# Altium schematic sheet fre_oa.SchDoc
size A4
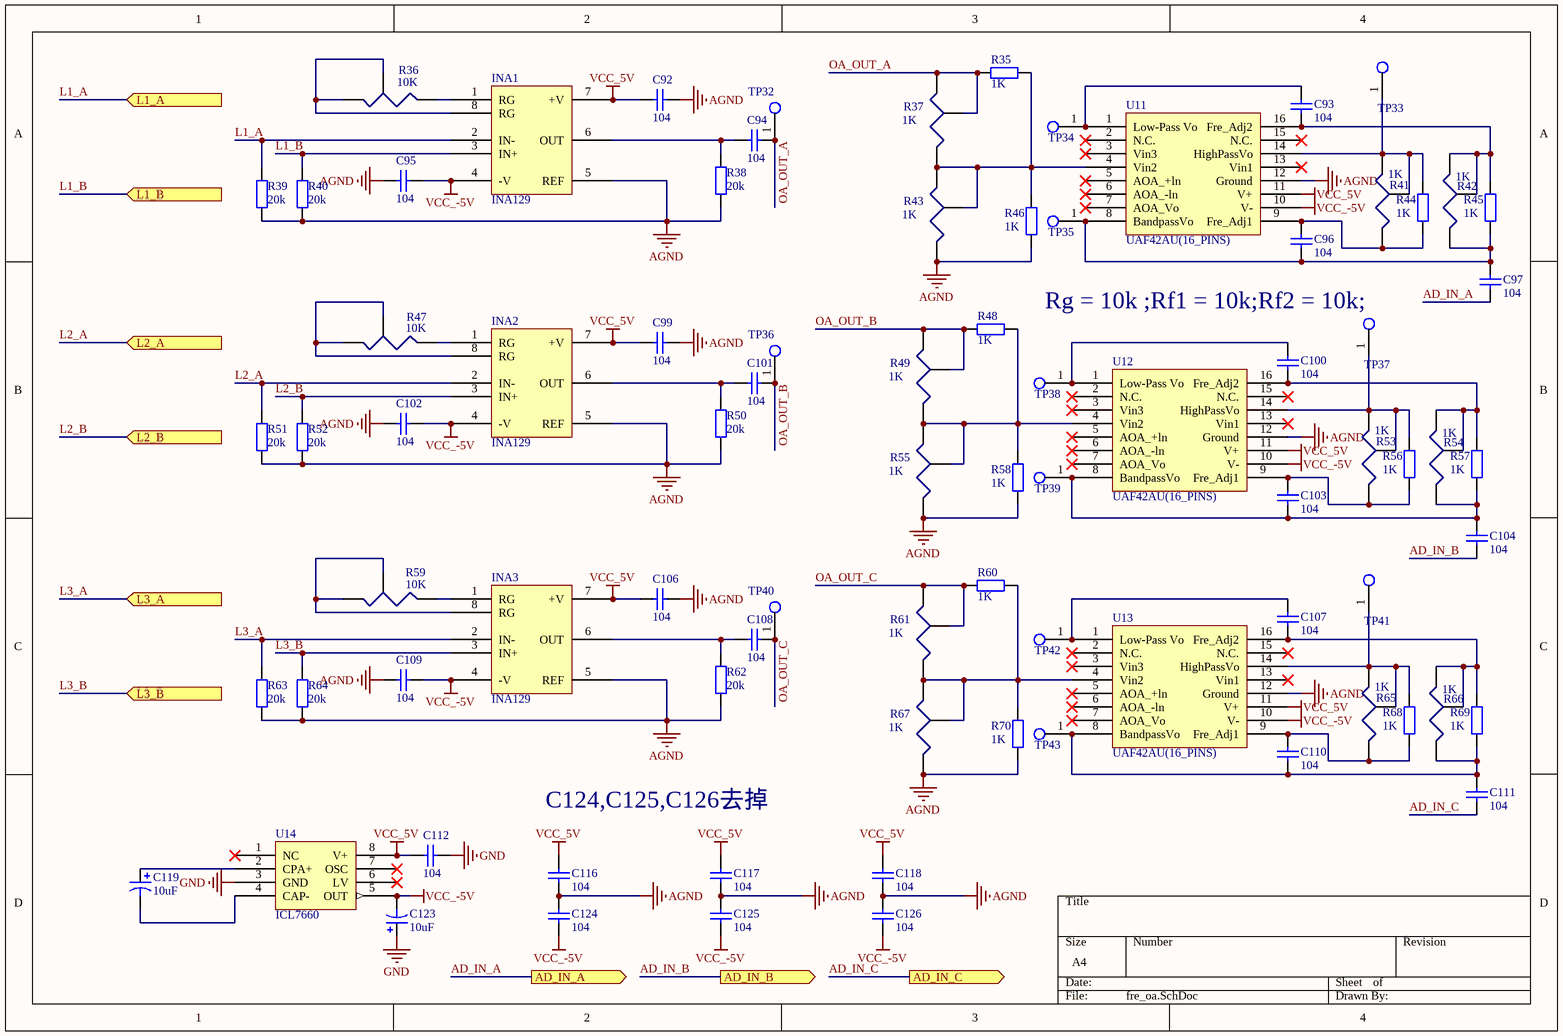
[diagram p0: fre_oa.SchDoc]

## Parts
C92  value 104  [0603]  (hidden comment: Cap)
C93  value 104  [0603]  (hidden comment: Cap)
C94  value 104  [0603]  (hidden comment: Cap)
C95  value 104  [0603]  (hidden comment: Cap)
C96  value 104  [0603]  (hidden comment: Cap)
C97  value 104  [0603]  (hidden comment: Cap)
C99  value 104  [0603]  (hidden comment: Cap)
C100  value 104  [0603]  (hidden comment: Cap)
C101  value 104  [0603]  (hidden comment: Cap)
C102  value 104  [0603]  (hidden comment: Cap)
C103  value 104  [0603]  (hidden comment: Cap)
C104  value 104  [0603]  (hidden comment: Cap)
C106  value 104  [0603]  (hidden comment: Cap)
C107  value 104  [0603]  (hidden comment: Cap)
C108  value 104  [0603]  (hidden comment: Cap)
C109  value 104  [0603]  (hidden comment: Cap)
C110  value 104  [0603]  (hidden comment: Cap)
C111  value 104  [0603]  (hidden comment: Cap)
C112  value 104  [0603]  (hidden comment: Cap)
C116  value 104  [0603]  (hidden comment: Cap)
C117  value 104  [0603]  (hidden comment: Cap)
C118  value 104  [0603]  (hidden comment: Cap)
C119  value 10uF  [Cap 3528B]  (hidden comment: Cap Poll)
C123  value 10uF  [Cap 3528B]  (hidden comment: Cap Poll)
C124  value 104  [0603]  (hidden comment: Cap)
C125  value 104  [0603]  (hidden comment: Cap)
C126  value 104  [0603]  (hidden comment: Cap)
INA1  INA129  [LM386]
INA2  INA129  [LM386]
INA3  INA129  [LM386]
R35  value 1K  [0603]  (hidden comment: Res)
R36  value 10K  [电位器WH06-2C]  (hidden comment: 电位器)
R37  value 1K  [电位器WH06-2C]  (hidden comment: 电位器)
R38  value 20k  [0603]  (hidden comment: Res)
R39  value 20k  [0603]  (hidden comment: Res)
R40  value 20k  [0603]  (hidden comment: Res)
R41  value 1K  [电位器WH06-2C]  (hidden comment: 电位器)
R42  value 1K  [电位器WH06-2C]  (hidden comment: 电位器)
R43  value 1K  [电位器WH06-2C]  (hidden comment: 电位器)
R44  value 1K  [0603]  (hidden comment: Res)
R45  value 1K  [0603]  (hidden comment: Res)
R46  value 1K  [0603]  (hidden comment: Res)
R47  value 10K  [电位器WH06-2C]  (hidden comment: 电位器)
R48  value 1K  [0603]  (hidden comment: Res)
R49  value 1K  [电位器WH06-2C]  (hidden comment: 电位器)
R50  value 20k  [0603]  (hidden comment: Res)
R51  value 20k  [0603]  (hidden comment: Res)
R52  value 20k  [0603]  (hidden comment: Res)
R53  value 1K  [电位器WH06-2C]  (hidden comment: 电位器)
R54  value 1K  [电位器WH06-2C]  (hidden comment: 电位器)
R55  value 1K  [电位器WH06-2C]  (hidden comment: 电位器)
R56  value 1K  [0603]  (hidden comment: Res)
R57  value 1K  [0603]  (hidden comment: Res)
R58  value 1K  [0603]  (hidden comment: Res)
R59  value 10K  [电位器WH06-2C]  (hidden comment: 电位器)
R60  value 1K  [0603]  (hidden comment: Res)
R61  value 1K  [电位器WH06-2C]  (hidden comment: 电位器)
R62  value 20k  [0603]  (hidden comment: Res)
R63  value 20k  [0603]  (hidden comment: Res)
R64  value 20k  [0603]  (hidden comment: Res)
R65  value 1K  [电位器WH06-2C]  (hidden comment: 电位器)
R66  value 1K  [电位器WH06-2C]  (hidden comment: 电位器)
R67  value 1K  [电位器WH06-2C]  (hidden comment: 电位器)
R68  value 1K  [0603]  (hidden comment: Res)
R69  value 1K  [0603]  (hidden comment: Res)
R70  value 1K  [0603]  (hidden comment: Res)
TP32  testPoint  [TP_H]  (value not drawn)
TP33  testPoint  [TP_H]  (value not drawn)
TP34  testPoint  [TP_H]  (value not drawn)
TP35  testPoint  [TP_H]  (value not drawn)
TP36  testPoint  [TP_H]  (value not drawn)
TP37  testPoint  [TP_H]  (value not drawn)
TP38  testPoint  [TP_H]  (value not drawn)
TP39  testPoint  [TP_H]  (value not drawn)
TP40  testPoint  [TP_H]  (value not drawn)
TP41  testPoint  [TP_H]  (value not drawn)
TP42  testPoint  [TP_H]  (value not drawn)
TP43  testPoint  [TP_H]  (value not drawn)
U11  UAF42AU(16_PINS)  [SOIC127P1030X265-16N]
U12  UAF42AU(16_PINS)  [SOIC127P1030X265-16N]
U13  UAF42AU(16_PINS)  [SOIC127P1030X265-16N]
U14  ICL7660  [ICL7660 sop-8]

## Ports
AD_IN_A (out), AD_IN_B (out), AD_IN_C (out), L1_A (in), L1_B (in), L2_A (in), L2_B (in), L3_A (in), L3_B (in)

## Nets
AGND: C92.2 C95.1 C99.2 C102.1 C106.2 C109.1 C116.1 C117.1 C118.1 C124.2 C125.2 C126.2 INA1.5(REF) INA2.5(REF) INA3.5(REF) R38.1 R39.1 R40.1 R43.1 R46.1 R50.1 R51.1 R52.1 R55.1 R58.1 R62.1 R63.1 R64.1 R67.1 R70.1 U11.12(Ground) U12.12(Ground) U13.12(Ground)
GND: C112.2 C123.1 U14.3(GND)
VCC_5V: C92.1 C99.1 C106.1 C112.1 C116.2 C117.2 C118.2 INA1.7(+V) INA2.7(+V) INA3.7(+V) U11.11(V+) U12.11(V+) U13.11(V+) U14.8(V+)
VCC_-5V: C95.2 C102.2 C109.2 C123.2 C124.1 C125.1 C126.1 INA1.4(-V) INA2.4(-V) INA3.4(-V) U11.10(V-) U12.10(V-) U13.10(V-) U14.5(OUT)
AD_IN_A: C97.2 ; port AD_IN_A
AD_IN_B: C104.2 ; port AD_IN_B
AD_IN_C: C111.2 ; port AD_IN_C
L1_A: INA1.2(IN-) R39.2 ; port L1_A
L1_B: INA1.3(IN+) R40.2 ; port L1_B
L2_A: INA2.2(IN-) R51.2 ; port L2_A
L2_B: INA2.3(IN+) R52.2 ; port L2_B
L3_A: INA3.2(IN-) R63.2 ; port L3_A
L3_B: INA3.3(IN+) R64.2 ; port L3_B
OA_OUT_A: C94.2 R35.1 R37.2 R37.3 TP32.1
OA_OUT_B: C101.2 R48.1 R49.2 R49.3 TP36.1
OA_OUT_C: C108.2 R60.1 R61.2 R61.3 TP40.1
NetC93_1: C93.1 TP34.1 U11.1(Low-Pass_Vo)
NetC93_2: C93.2 R42.2 R42.3 R45.2 U11.16(Fre_Adj2)
NetC94_1: C94.1 INA1.6(OUT) R38.2
NetC96_1: C96.1 R41.1 R44.1 U11.9(Fre_Adj1)
NetC96_2: C96.2 C97.1 R42.1 R45.1 TP35.1 U11.8(BandpassVo)
NetC100_1: C100.1 TP38.1 U12.1(Low-Pass_Vo)
NetC100_2: C100.2 R54.2 R54.3 R57.2 U12.16(Fre_Adj2)
NetC101_1: C101.1 INA2.6(OUT) R50.2
NetC103_1: C103.1 R53.1 R56.1 U12.9(Fre_Adj1)
NetC103_2: C103.2 C104.1 R54.1 R57.1 TP39.1 U12.8(BandpassVo)
NetC107_1: C107.1 TP42.1 U13.1(Low-Pass_Vo)
NetC107_2: C107.2 R66.2 R66.3 R69.2 U13.16(Fre_Adj2)
NetC108_1: C108.1 INA3.6(OUT) R62.2
NetC110_1: C110.1 R65.1 R68.1 U13.9(Fre_Adj1)
NetC110_2: C110.2 C111.1 R66.1 R69.1 TP43.1 U13.8(BandpassVo)
NetC119_1: C119.1 U14.2(CPA+)
NetC119_2: C119.2 U14.4(CAP-)
NetINA1_1: INA1.1(RG) R36.1
NetINA1_8: INA1.8(RG) R36.2 R36.3
NetINA2_1: INA2.1(RG) R47.1
NetINA2_8: INA2.8(RG) R47.2 R47.3
NetINA3_1: INA3.1(RG) R59.1
NetINA3_8: INA3.8(RG) R59.2 R59.3
NetR35_2: R35.2 R37.1 R43.2 R43.3 R46.2 U11.4(Vin2)
NetR41_2: R41.2 R41.3 R44.2 TP33.1 U11.14(HighPassVo)
NetR48_2: R48.2 R49.1 R55.2 R55.3 R58.2 U12.4(Vin2)
NetR53_2: R53.2 R53.3 R56.2 TP37.1 U12.14(HighPassVo)
NetR60_2: R60.2 R61.1 R67.2 R67.3 R70.2 U13.4(Vin2)
NetR65_2: R65.2 R65.3 R68.2 TP41.1 U13.14(HighPassVo)

Not connected (* = marked no-connect by the designer): U11 2(N.C.)* 3(Vin3)* 5(AOA_+ln)* 6(AOA_-ln)* 7(AOA_Vo)* 13(Vin1)* 15(N.C.)*; U12 2(N.C.)* 3(Vin3)* 5(AOA_+ln)* 6(AOA_-ln)* 7(AOA_Vo)* 13(Vin1)* 15(N.C.)*; U13 2(N.C.)* 3(Vin3)* 5(AOA_+ln)* 6(AOA_-ln)* 7(AOA_Vo)* 13(Vin1)* 15(N.C.)*; U14 1(NC)* 6(LV)* 7(OSC)*

## Notes on the sheet
- (near TP37) Rg = 10k ;Rf1 = 10k;Rf2 = 10k;
- C124,C125,C126去掉

## Library data of the parts
C92-C97 C99-C104 C106-C112 C116-C118 C124-C126 = Cap: 原理图绘制者: 刘永钦; 原理图何处使用过: 2014年飞思卡尔底板; 原理图审核人1: 徐鹏飞; 封装0805何处使用: 2015年航行器遥控器; 原理图审核人2: 朱觉文; 封装0603何处使用过: 在2401转接板上使用; Pressure Voltage: 16V; 原理图提供者: 刘永钦; 封装0805绘制者: 刘永钦; 封装0805提供者: 刘永钦; 封装0805审核人1: 徐鹏飞; 封装0805审核人2: 朱觉文; 封装0603绘制者: 刘永钦; 封装0603提供者: 刘永钦; 封装0603审核人1: 朱觉文; 封装0603审核人2: 徐鹏飞
C119 C123 = Cap Poll: 原理图绘制者: 刘永钦; 原理图何处使用过: 2014年飞思卡尔底板; 原理图审核人1: 徐鹏飞; 封装CAP 钽 7343 E何处使用: 2014年飞思卡尔驱动板; 封装cap贴片铝电解质470uF 16V绘制者: 李泽; 封装cap贴片铝电解质470uF 16V何处使用: 2015年飞思卡尔主板; 封装Cap 3528B绘制者: 陈汉诚; 封装Cap 3528B使用过: 2015年飞思卡尔驱动板; 封装Cap直插 10uF 50V: 10级718学长; 封装Cap直插 10uF 50V使用过: 2012年XS128学习板的主板; 封装Cap 3528B审核人2: 朱觉文; Pressure Voltage: 16V; 原理图提供者: 刘永钦; 封装CAP 钽 7343 E绘制者: 刘永钦; 封装CAP 钽 7343 E提供者: 刘永钦; 封装CAP 钽 7343 E审核人1: 徐鹏飞; 封装cap贴片铝电解质470uF 16V提供者: 刘永钦; 封装cap贴片铝电解质470uF 16V审核人1: 徐鹏飞; 封装Cap 3528B提供者: 刘永钦; 封装Cap 3528B审核人1: 徐鹏飞; 封装Cap直插 10uF 50V提供者: 刘永钦; 封装Cap直插 10uF 50V审核人1: 徐鹏飞; 封装Cap直插 10uF 50V审核人2: 朱觉文; 封装cap贴片铝电解质470uF 16V审核人2: 朱觉文; 封装CAP 钽 7343 E审核人2: 朱觉文; 原理图审核人2: 朱觉文
R35 R38-R40 R44-R46 R48 R50-R52 R56-R58 R60 R62-R64 R68-R70 = Res: 原理图绘制者: 刘永钦; 原理图何处使用过: 2014年飞思卡尔底板; 原理图审核人1: 徐鹏飞; 封装0805何处使用过: 2015年航行器遥控器; 原理图审核人2: 朱觉文; 封装2512-RESC6332X06N何处使用过: 在无刷直流电机驱动板上使用过; 封装0603何处使用过: 在2401转接板上使用; 原理图提供者: 刘永钦; 封装0805绘制者: 刘永钦; 封装0805提供者: 刘永钦; 封装0805审核人1: 徐鹏飞; 封装0805审核人2: 朱觉文; 封装0603提供者: 刘永钦; 封装0603审核人2: 朱觉文; 封装0603审核人1: 徐鹏飞; 封装2512-RESC6332X06N审核人2: 朱觉文; 封装2512-RESC6332X06N提供者: 刘永钦; 封装2512-RESC6332X06N审核人1: 徐鹏飞; 封装0603绘制者: 刘永钦; 封装2512-RESC6332X06N绘制者: 刘永钦
R36 R37 R41-R43 R47 R49 R53-R55 R59 R61 R65-R67 = 电位器: 原理图绘制者: 刘永钦; 原理图何处使用过: 2014年飞思卡尔底板; 原理图审核人1: 徐鹏飞; 封装电位器WH06-2C使用过: 2014年小板子; 封装电位器 097单联弯脚使用过: 2015年航行器遥控器; 原理图审核人2: 朱觉文; 原理图提供者: 刘永钦; 封装电位器WH06-2C绘制者: 刘永钦; 封装电位器WH06-2C审核人1: 徐鹏飞; 封装电位器WH06-2C提供者: 刘永钦; 封装电位器 097单联弯脚绘制者: 刘永钦; 封装电位器 097单联弯脚提供者: 刘永钦; 封装电位器 097单联弯脚审核人1: 徐鹏飞; 封装电位器 097单联弯脚审核人2: 朱觉文; 封装电位器WH06-2C审核人2: 朱觉文
TP32-TP43 = TP
U14 = ICL7660: 原理图绘制者: 刘永钦; 原理图何处使用过: 2014年飞思卡尔底板; 原理图审核人1: 徐鹏飞; 封装ICL7660 sop-8使用过: 2014年飞思卡尔地板; 原理图审核人2: 朱觉文; 原理图提供者: 刘永钦; 封装ICL7660 sop-8绘制者: 刘永钦; 封装ICL7660 sop-8审核人1: 徐鹏飞; 封装ICL7660 sop-8提供者: 刘永钦; 封装ICL7660 sop-8审核人2: 朱觉文